# Altium project EBPM-RFFE-Ver1.PrjPCB (part 1 of 3)
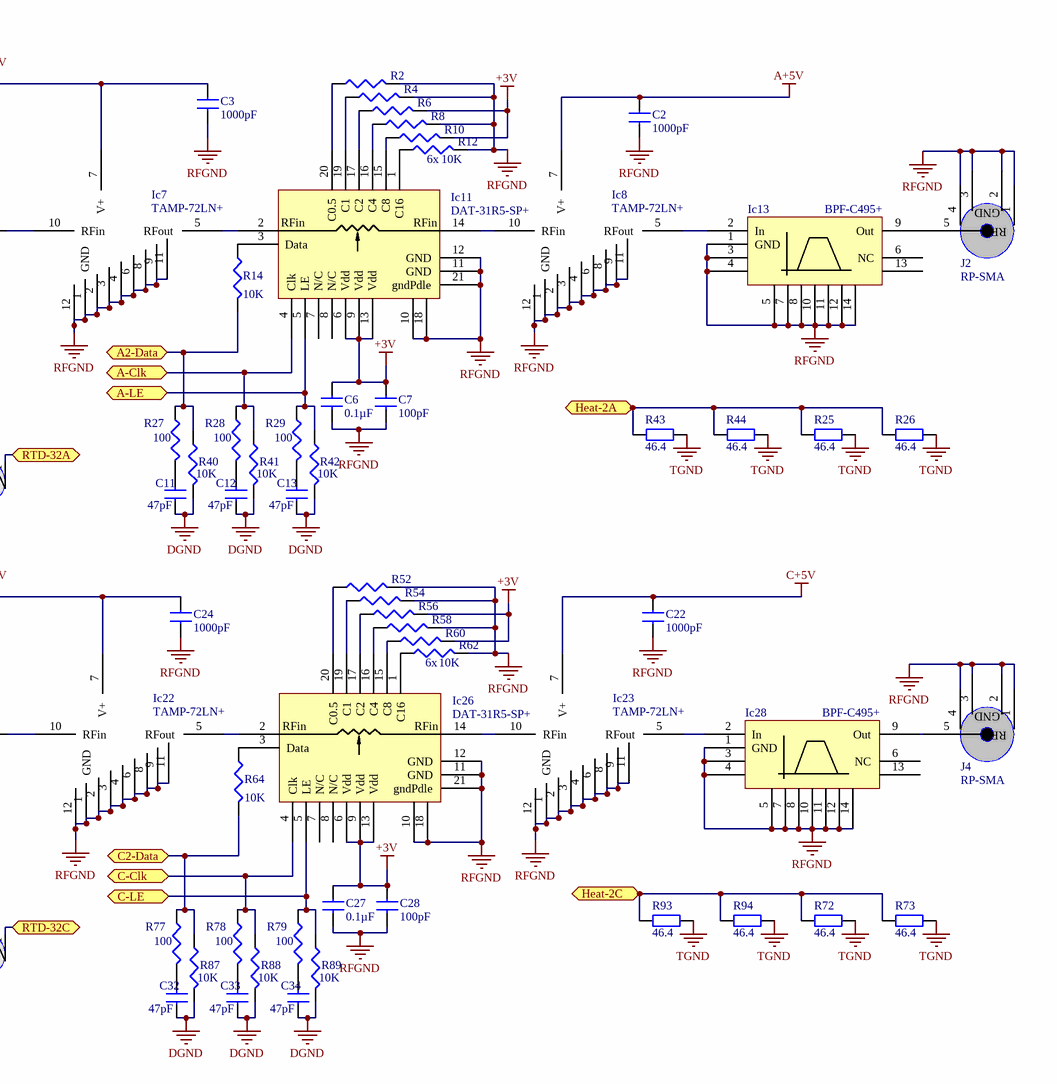
[diagram p0: RFFE-Ver1.SchDoc, top right]
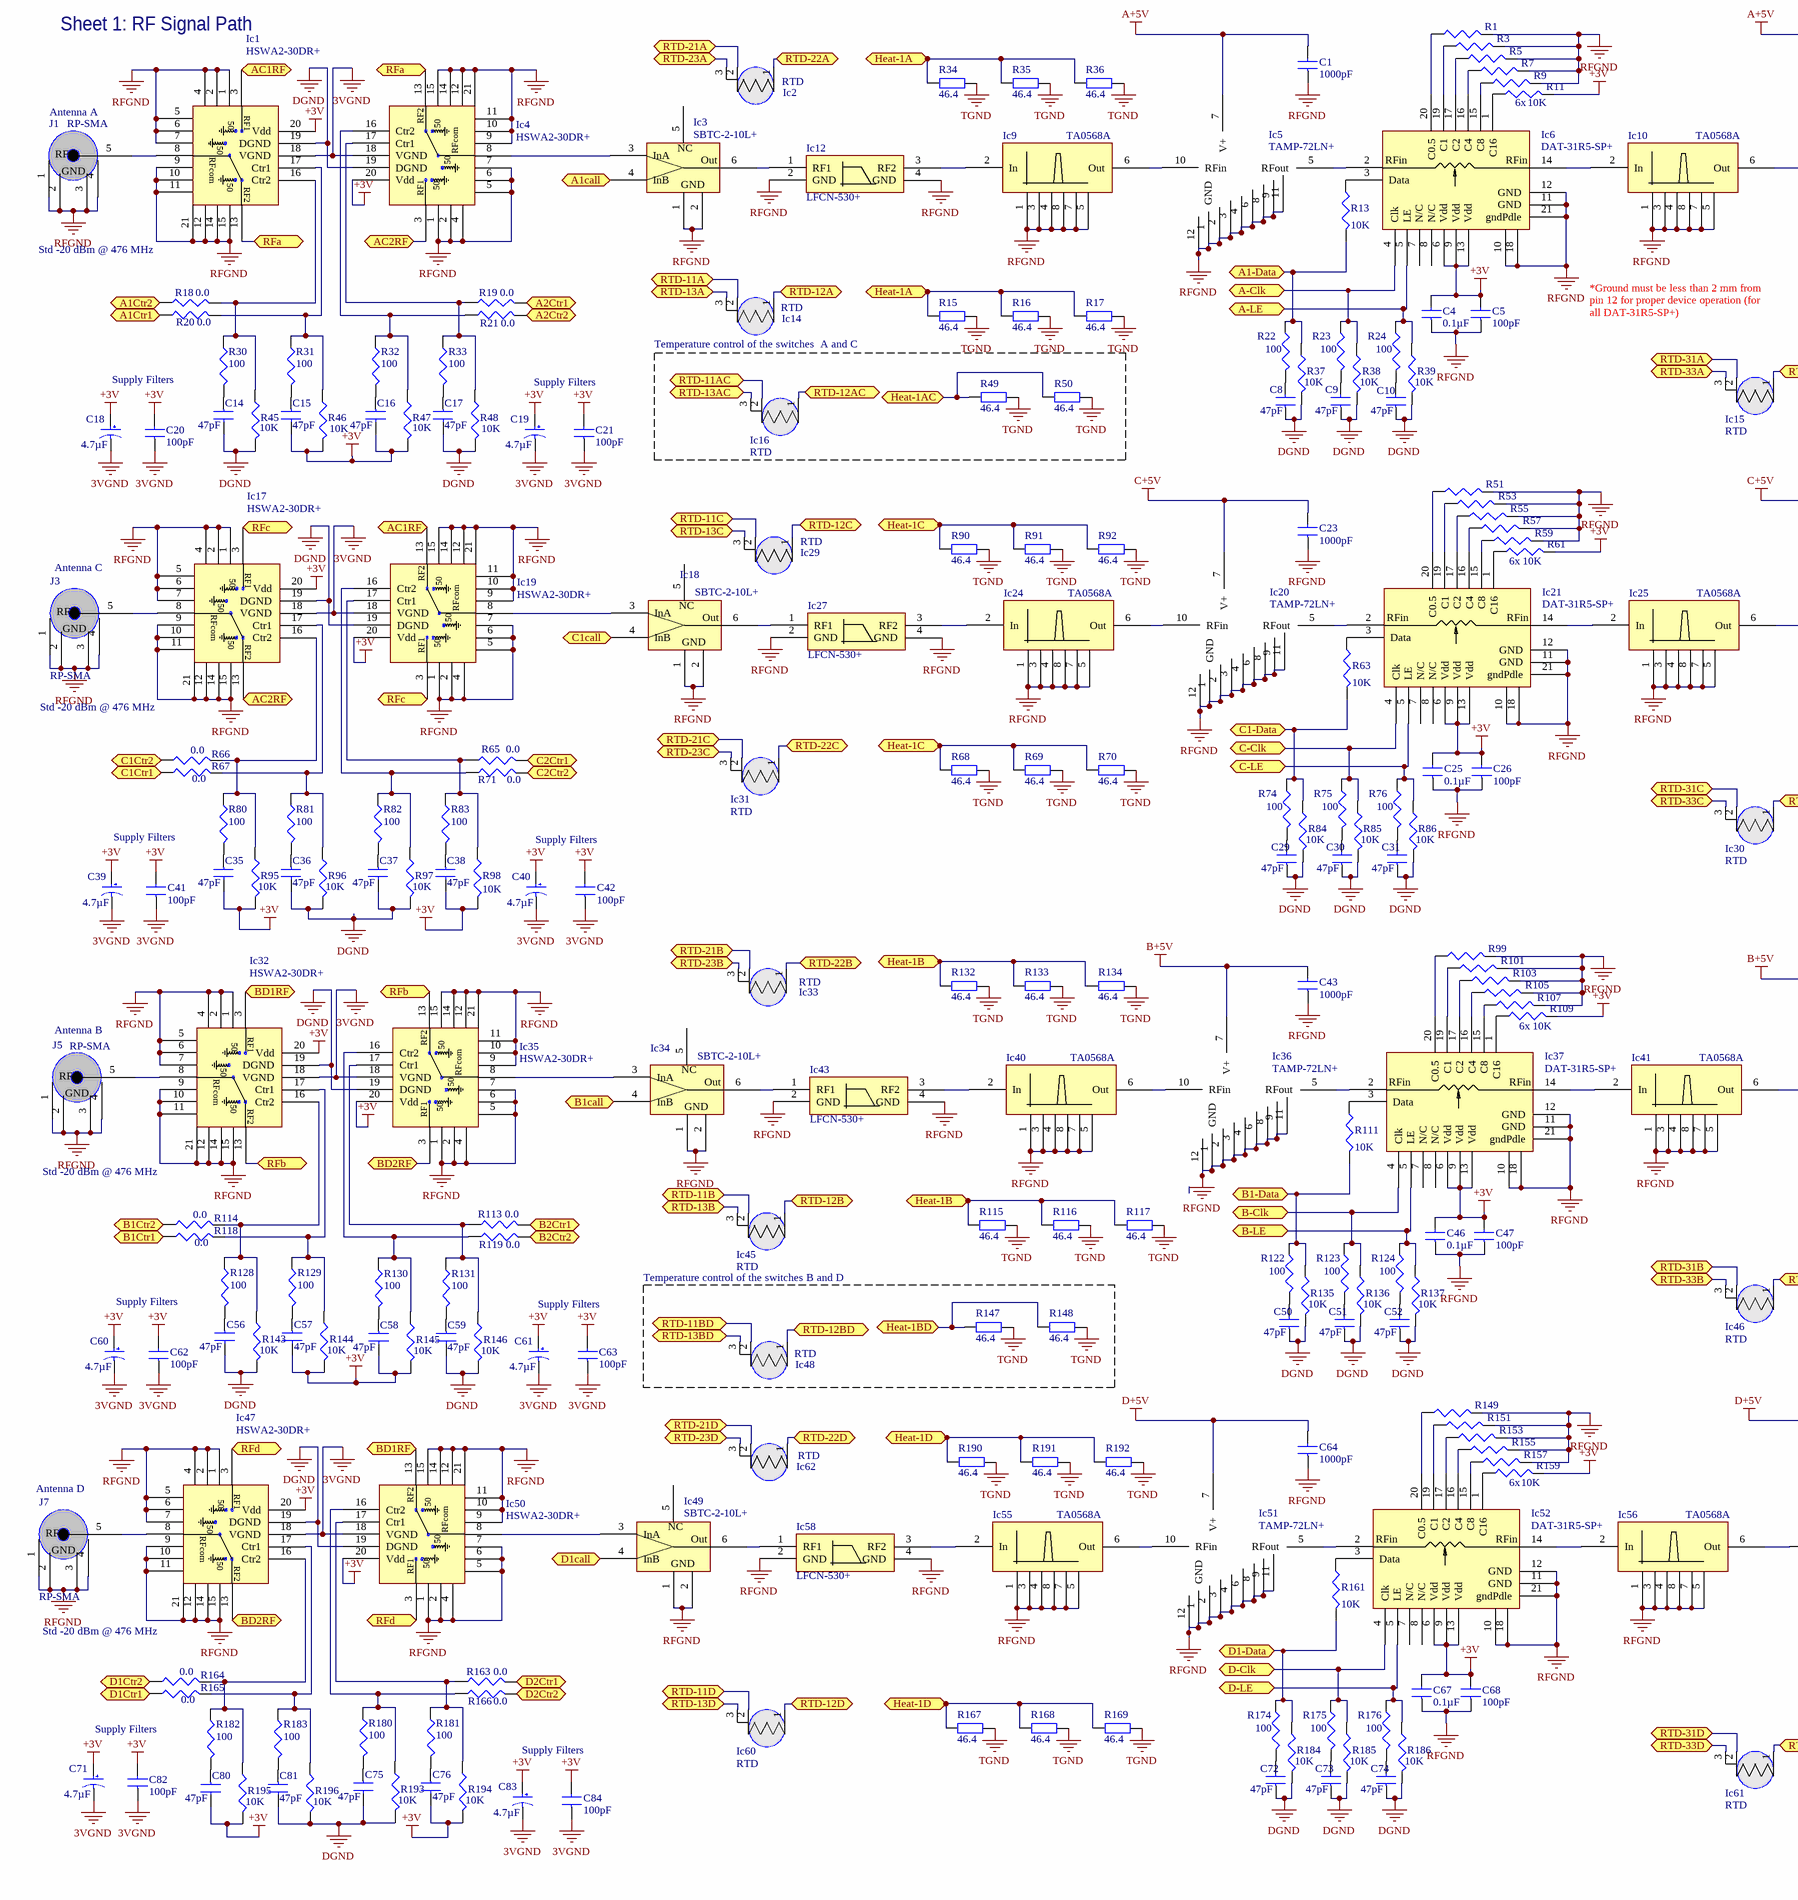
[diagram p1: RFFE-Ver1.SchDoc, bottom left]
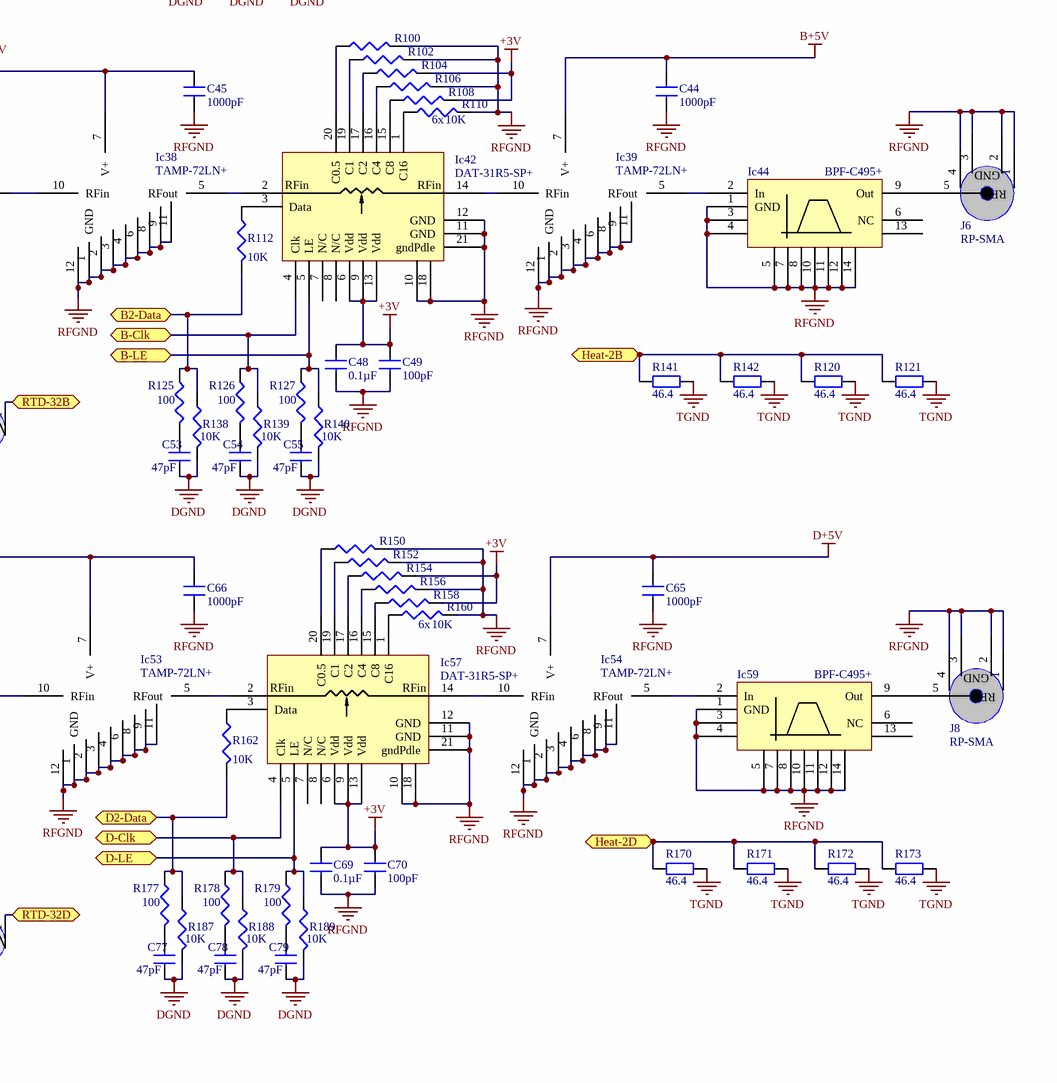
[diagram p2: RFFE-Ver1.SchDoc, bottom right]
3 sheets, 522 parts. Net scope: global (net labels, ports and power ports of the same name join across sheets).
Board file: RFFE-Ver1A.PcbDoc
Sheets:
  RFFE-Ver1.SchDoc
  RFFE-Pilot-Ver1.SchDoc
  RFFE-Supply-Ver1.SchDoc

## Sheet RFFE-Ver1.SchDoc: EBPM-RFFE - Versão 1
size A2; DrawnBy: *Rafael Baron; SheetNumber: 1; SheetTotal: 3; PageSetup: Record=PageOptions|CenterHorizontal=True|CenterVertical=True|PrintScale=0.50|XCorrection=1.00|YCorrection=1.00|PrintKind=1|BorderSize=5000000|LeftOffset=0|BottomOffset=0|Orientation=2|PaperLength=1000|PaperWidth=1000|Scale=100|PaperSource=15|PrintQuality=600|MediaType=1|DitherType=10|PaperKind=A4|PrintScaleMode=1; EBPM-RFFE - Versão 1: EBPM-RFFE - Versão 1

### Parts
C1  Capacitance: 1000pF  [CAPC1608M]  (hidden comment: C1608C0G1H102J)
C2  Capacitance: 1000pF  [CAPC1608M]  (hidden comment: C1608C0G1H102J)
C3  Capacitance: 1000pF  [CAPC1608M]  (hidden comment: C1608C0G1H102J)
C4  Capacitance: 0.1µF  [CAPC3216M]  (hidden comment: CAP CER 0.1UF)
C5  Capacitance: 100pF  [CAPC1608N]  (hidden comment: C1608C0G1H101J)
C6  Capacitance: 0.1µF  [CAPC3216M]  (hidden comment: CAP CER 0.1UF)
C7  Capacitance: 100pF  [CAPC1608N]  (hidden comment: C1608C0G1H101J)
C8  Capacitance: 47pF  [CAPC1608N]  (hidden comment: C1608C0G1H470J)
C9  Capacitance: 47pF  [CAPC1608N]  (hidden comment: C1608C0G1H470J)
C10  Capacitance: 47pF  [CAPC1608N]  (hidden comment: C1608C0G1H470J)
C11  Capacitance: 47pF  [CAPC1608N]  (hidden comment: C1608C0G1H470J)
C12  Capacitance: 47pF  [CAPC1608N]  (hidden comment: C1608C0G1H470J)
C13  Capacitance: 47pF  [CAPC1608N]  (hidden comment: C1608C0G1H470J)
C14  Capacitance: 47pF  [CAPC1608N]  (hidden comment: C1608C0G1H470J)
C15  Capacitance: 47pF  [CAPC1608N]  (hidden comment: C1608C0G1H470J)
C16  Capacitance: 47pF  [CAPC1608N]  (hidden comment: C1608C0G1H470J)
C17  Capacitance: 47pF  [CAPC1608N]  (hidden comment: C1608C0G1H470J)
C18  Capacitance: 4.7µF  [TC3528-1411]  (hidden comment: CAP TANT 4.7UF)
C19  Capacitance: 4.7µF  [TC3528-1411]  (hidden comment: CAP TANT 4.7UF)
C20  Capacitance: 100pF  [CAPC1608N]  (hidden comment: C1608C0G1H101J)
C21  Capacitance: 100pF  [CAPC1608N]  (hidden comment: C1608C0G1H101J)
C22  Capacitance: 1000pF  [CAPC1608M]  (hidden comment: C1608C0G1H102J)
C23  Capacitance: 1000pF  [CAPC1608M]  (hidden comment: C1608C0G1H102J)
C24  Capacitance: 1000pF  [CAPC1608M]  (hidden comment: C1608C0G1H102J)
C25  Capacitance: 0.1µF  [CAPC3216M]  (hidden comment: CAP CER 0.1UF)
C26  Capacitance: 100pF  [CAPC1608N]  (hidden comment: C1608C0G1H101J)
C27  Capacitance: 0.1µF  [CAPC3216M]  (hidden comment: CAP CER 0.1UF)
C28  Capacitance: 100pF  [CAPC1608N]  (hidden comment: C1608C0G1H101J)
C29  Capacitance: 47pF  [CAPC1608N]  (hidden comment: C1608C0G1H470J)
C30  Capacitance: 47pF  [CAPC1608N]  (hidden comment: C1608C0G1H470J)
C31  Capacitance: 47pF  [CAPC1608N]  (hidden comment: C1608C0G1H470J)
C32  Capacitance: 47pF  [CAPC1608N]  (hidden comment: C1608C0G1H470J)
C33  Capacitance: 47pF  [CAPC1608N]  (hidden comment: C1608C0G1H470J)
C34  Capacitance: 47pF  [CAPC1608N]  (hidden comment: C1608C0G1H470J)
C35  Capacitance: 47pF  [CAPC1608N]  (hidden comment: C1608C0G1H470J)
C36  Capacitance: 47pF  [CAPC1608N]  (hidden comment: C1608C0G1H470J)
C37  Capacitance: 47pF  [CAPC1608N]  (hidden comment: C1608C0G1H470J)
C38  Capacitance: 47pF  [CAPC1608N]  (hidden comment: C1608C0G1H470J)
C39  Capacitance: 4.7µF  [TC3528-1411]  (hidden comment: CAP TANT 4.7UF)
C40  Capacitance: 4.7µF  [TC3528-1411]  (hidden comment: CAP TANT 4.7UF)
C41  Capacitance: 100pF  [CAPC1608N]  (hidden comment: C1608C0G1H101J)
C42  Capacitance: 100pF  [CAPC1608N]  (hidden comment: C1608C0G1H101J)
C43  Capacitance: 1000pF  [CAPC1608M]  (hidden comment: C1608C0G1H102J)
C44  Capacitance: 1000pF  [CAPC1608M]  (hidden comment: C1608C0G1H102J)
C45  Capacitance: 1000pF  [CAPC1608M]  (hidden comment: C1608C0G1H102J)
C46  Capacitance: 0.1µF  [CAPC3216M]  (hidden comment: CAP CER 0.1UF)
C47  Capacitance: 100pF  [CAPC1608N]  (hidden comment: C1608C0G1H101J)
C48  Capacitance: 0.1µF  [CAPC3216M]  (hidden comment: CAP CER 0.1UF)
C49  Capacitance: 100pF  [CAPC1608N]  (hidden comment: C1608C0G1H101J)
C50  Capacitance: 47pF  [CAPC1608N]  (hidden comment: C1608C0G1H470J)
C51  Capacitance: 47pF  [CAPC1608N]  (hidden comment: C1608C0G1H470J)
C52  Capacitance: 47pF  [CAPC1608N]  (hidden comment: C1608C0G1H470J)
C53  Capacitance: 47pF  [CAPC1608N]  (hidden comment: C1608C0G1H470J)
C54  Capacitance: 47pF  [CAPC1608N]  (hidden comment: C1608C0G1H470J)
C55  Capacitance: 47pF  [CAPC1608N]  (hidden comment: C1608C0G1H470J)
C56  Capacitance: 47pF  [CAPC1608N]  (hidden comment: C1608C0G1H470J)
C57  Capacitance: 47pF  [CAPC1608N]  (hidden comment: C1608C0G1H470J)
C58  Capacitance: 47pF  [CAPC1608N]  (hidden comment: C1608C0G1H470J)
C59  Capacitance: 47pF  [CAPC1608N]  (hidden comment: C1608C0G1H470J)
C60  Capacitance: 4.7µF  [TC3528-1411]  (hidden comment: CAP TANT 4.7UF)
C61  Capacitance: 4.7µF  [TC3528-1411]  (hidden comment: CAP TANT 4.7UF)
C62  Capacitance: 100pF  [CAPC1608N]  (hidden comment: C1608C0G1H101J)
C63  Capacitance: 100pF  [CAPC1608N]  (hidden comment: C1608C0G1H101J)
C64  Capacitance: 1000pF  [CAPC1608M]  (hidden comment: C1608C0G1H102J)
C65  Capacitance: 1000pF  [CAPC1608M]  (hidden comment: C1608C0G1H102J)
C66  Capacitance: 1000pF  [CAPC1608M]  (hidden comment: C1608C0G1H102J)
C67  Capacitance: 0.1µF  [CAPC3216M]  (hidden comment: CAP CER 0.1UF)
C68  Capacitance: 100pF  [CAPC1608N]  (hidden comment: C1608C0G1H101J)
C69  Capacitance: 0.1µF  [CAPC3216M]  (hidden comment: CAP CER 0.1UF)
C70  Capacitance: 100pF  [CAPC1608N]  (hidden comment: C1608C0G1H101J)
C71  Capacitance: 4.7µF  [TC3528-1411]  (hidden comment: CAP TANT 4.7UF)
C72  Capacitance: 47pF  [CAPC1608N]  (hidden comment: C1608C0G1H470J)
C73  Capacitance: 47pF  [CAPC1608N]  (hidden comment: C1608C0G1H470J)
C74  Capacitance: 47pF  [CAPC1608N]  (hidden comment: C1608C0G1H470J)
C75  Capacitance: 47pF  [CAPC1608N]  (hidden comment: C1608C0G1H470J)
C76  Capacitance: 47pF  [CAPC1608N]  (hidden comment: C1608C0G1H470J)
C77  Capacitance: 47pF  [CAPC1608N]  (hidden comment: C1608C0G1H470J)
C78  Capacitance: 47pF  [CAPC1608N]  (hidden comment: C1608C0G1H470J)
C79  Capacitance: 47pF  [CAPC1608N]  (hidden comment: C1608C0G1H470J)
C80  Capacitance: 47pF  [CAPC1608N]  (hidden comment: C1608C0G1H470J)
C81  Capacitance: 47pF  [CAPC1608N]  (hidden comment: C1608C0G1H470J)
C82  Capacitance: 100pF  [CAPC1608N]  (hidden comment: C1608C0G1H101J)
C83  Capacitance: 4.7µF  [TC3528-1411]  (hidden comment: CAP TANT 4.7UF)
C84  Capacitance: 100pF  [CAPC1608N]  (hidden comment: C1608C0G1H101J)
Ic1  HSWA2-30DR+  [DG983-1]
Ic2  Thermistor Type: RTD  [RTDx2]  (hidden comment: DETECTOR RTD TF 100 OHM +/-0.06%)
Ic3  SBTC-2-10L+  [AT1029]
Ic4  HSWA2-30DR+  [DG983-1]
Ic5  TAMP-72LN+  [JQ1382]
Ic6  DAT-31R5-SP+  [DG983-1]
Ic7  TAMP-72LN+  [JQ1382]
Ic8  TAMP-72LN+  [JQ1382]
Ic9  TA0568A  [TST-TA0568A]
Ic10  TA0568A  [TST-TA0568A]
Ic11  DAT-31R5-SP+  [DG983-1]
Ic12  LFCN-530+  [FV1206]
Ic13  BPF-C495+  [HU1186]
Ic14  Thermistor Type: RTD  [RTDx2]  (hidden comment: DETECTOR RTD TF 100 OHM +/-0.06%)
Ic15  Thermistor Type: RTD  [RTDx2]  (hidden comment: DETECTOR RTD TF 100 OHM +/-0.06%)
Ic16  Thermistor Type: RTD  [RTDx2]  (hidden comment: DETECTOR RTD TF 100 OHM +/-0.06%)
Ic17  HSWA2-30DR+  [DG983-1]
Ic18  SBTC-2-10L+  [AT1029]
Ic19  HSWA2-30DR+  [DG983-1]
Ic20  TAMP-72LN+  [JQ1382]
Ic21  DAT-31R5-SP+  [DG983-1]
Ic22  TAMP-72LN+  [JQ1382]
Ic23  TAMP-72LN+  [JQ1382]
Ic24  TA0568A  [TST-TA0568A]
Ic25  TA0568A  [TST-TA0568A]
Ic26  DAT-31R5-SP+  [DG983-1]
Ic27  LFCN-530+  [FV1206]
Ic28  BPF-C495+  [HU1186]
Ic29  Thermistor Type: RTD  [RTDx2]  (hidden comment: DETECTOR RTD TF 100 OHM +/-0.06%)
Ic30  Thermistor Type: RTD  [RTDx2]  (hidden comment: DETECTOR RTD TF 100 OHM +/-0.06%)
Ic31  Thermistor Type: RTD  [RTDx2]  (hidden comment: DETECTOR RTD TF 100 OHM +/-0.06%)
Ic32  HSWA2-30DR+  [DG983-1]
Ic33  Thermistor Type: RTD  [RTDx2]  (hidden comment: DETECTOR RTD TF 100 OHM +/-0.06%)
Ic34  SBTC-2-10L+  [AT1029]
Ic35  HSWA2-30DR+  [DG983-1]
Ic36  TAMP-72LN+  [JQ1382]
Ic37  DAT-31R5-SP+  [DG983-1]
Ic38  TAMP-72LN+  [JQ1382]
Ic39  TAMP-72LN+  [JQ1382]
Ic40  TA0568A  [TST-TA0568A]
Ic41  TA0568A  [TST-TA0568A]
Ic42  DAT-31R5-SP+  [DG983-1]
Ic43  LFCN-530+  [FV1206]
Ic44  BPF-C495+  [HU1186]
Ic45  Thermistor Type: RTD  [RTDx2]  (hidden comment: DETECTOR RTD TF 100 OHM +/-0.06%)
Ic46  Thermistor Type: RTD  [RTDx2]  (hidden comment: DETECTOR RTD TF 100 OHM +/-0.06%)
Ic47  HSWA2-30DR+  [DG983-1]
Ic48  Thermistor Type: RTD  [RTDx2]  (hidden comment: DETECTOR RTD TF 100 OHM +/-0.06%)
Ic49  SBTC-2-10L+  [AT1029]
Ic50  HSWA2-30DR+  [DG983-1]
Ic51  TAMP-72LN+  [JQ1382]
Ic52  DAT-31R5-SP+  [DG983-1]
Ic53  TAMP-72LN+  [JQ1382]
Ic54  TAMP-72LN+  [JQ1382]
Ic55  TA0568A  [TST-TA0568A]
Ic56  TA0568A  [TST-TA0568A]
Ic57  DAT-31R5-SP+  [DG983-1]
Ic58  LFCN-530+  [FV1206]
Ic59  BPF-C495+  [HU1186]
Ic60  Thermistor Type: RTD  [RTDx2]  (hidden comment: DETECTOR RTD TF 100 OHM +/-0.06%)
Ic61  Thermistor Type: RTD  [RTDx2]  (hidden comment: DETECTOR RTD TF 100 OHM +/-0.06%)
Ic62  Thermistor Type: RTD  [RTDx2]  (hidden comment: DETECTOR RTD TF 100 OHM +/-0.06%)
J1  Connector Style: RP-SMA  [SMAedge50R]  (hidden comment: CONN SMA)
J2  Connector Style: RP-SMA  [SMAedge50R]  (hidden comment: CONN SMA)
J3  Connector Style: RP-SMA  [SMAedge50R]  (hidden comment: CONN SMA)
J4  Connector Style: RP-SMA  [SMAedge50R]  (hidden comment: CONN SMA)
J5  Connector Style: RP-SMA  [SMAedge50R]  (hidden comment: CONN SMA)
J6  Connector Style: RP-SMA  [SMAedge50R]  (hidden comment: CONN SMA)
J7  Connector Style: RP-SMA  [SMAedge50R]  (hidden comment: CONN SMA)
J8  Connector Style: RP-SMA  [SMAedge50R]  (hidden comment: CONN SMA)
R1  PNM0603E1002BST5  [RESC1608N]  (value not drawn)
R2  PNM0603E1002BST5  [RESC1608N]  (value not drawn)
R3  PNM0603E1002BST5  [RESC1608N]  (value not drawn)
R4  PNM0603E1002BST5  [RESC1608N]  (value not drawn)
R5  PNM0603E1002BST5  [RESC1608N]  (value not drawn)
R6  PNM0603E1002BST5  [RESC1608N]  (value not drawn)
R7  PNM0603E1002BST5  [RESC1608N]  (value not drawn)
R8  PNM0603E1002BST5  [RESC1608N]  (value not drawn)
R9  PNM0603E1002BST5  [RESC1608N]  (value not drawn)
R10  PNM0603E1002BST5  [RESC1608N]  (value not drawn)
R11  Resistance (Ohms): 10K  [RESC1608N]  (hidden comment: PNM0603E1002BST5)
R12  Resistance (Ohms): 10K  [RESC1608N]  (hidden comment: PNM0603E1002BST5)
R13  Resistance (Ohms): 10K  [RESC1608N]  (hidden comment: PNM0603E1002BST5)
R14  Resistance (Ohms): 10K  [RESC1608N]  (hidden comment: PNM0603E1002BST5)
R15  Resistance (Ohms): 46.4  [AXIAL9.0]  (hidden comment: CMF5546R400FHEB)
R16  Resistance (Ohms): 46.4  [AXIAL9.0]  (hidden comment: CMF5546R400FHEB)
R17  Resistance (Ohms): 46.4  [AXIAL9.0]  (hidden comment: CMF5546R400FHEB)
R18  Resistance (Ohms): 0.0  [RESC1608M]  (hidden comment: RES 0.0 OHM)
R19  Resistance (Ohms): 0.0  [RESC1608M]  (hidden comment: RES 0.0 OHM)
R20  Resistance (Ohms): 0.0  [RESC1608M]  (hidden comment: RES 0.0 OHM)
R21  Resistance (Ohms): 0.0  [RESC1608M]  (hidden comment: RES 0.0 OHM)
R22  Resistance (Ohms): 100  [RESC1608N]  (hidden comment: FC0603E1000BST1)
R23  Resistance (Ohms): 100  [RESC1608N]  (hidden comment: FC0603E1000BST1)
R24  Resistance (Ohms): 100  [RESC1608N]  (hidden comment: FC0603E1000BST1)
R25  Resistance (Ohms): 46.4  [AXIAL9.0]  (hidden comment: CMF5546R400FHEB)
R26  Resistance (Ohms): 46.4  [AXIAL9.0]  (hidden comment: CMF5546R400FHEB)
R27  Resistance (Ohms): 100  [RESC1608N]  (hidden comment: FC0603E1000BST1)
R28  Resistance (Ohms): 100  [RESC1608N]  (hidden comment: FC0603E1000BST1)
R29  Resistance (Ohms): 100  [RESC1608N]  (hidden comment: FC0603E1000BST1)
R30  Resistance (Ohms): 100  [RESC1608N]  (hidden comment: FC0603E1000BST1)
R31  Resistance (Ohms): 100  [RESC1608N]  (hidden comment: FC0603E1000BST1)
R32  Resistance (Ohms): 100  [RESC1608N]  (hidden comment: FC0603E1000BST1)
R33  Resistance (Ohms): 100  [RESC1608N]  (hidden comment: FC0603E1000BST1)
R34  Resistance (Ohms): 46.4  [AXIAL9.0]  (hidden comment: CMF5546R400FHEB)
R35  Resistance (Ohms): 46.4  [AXIAL9.0]  (hidden comment: CMF5546R400FHEB)
R36  Resistance (Ohms): 46.4  [AXIAL9.0]  (hidden comment: CMF5546R400FHEB)
R37  Resistance (Ohms): 10K  [RESC1608N]  (hidden comment: PNM0603E1002BST5)
R38  Resistance (Ohms): 10K  [RESC1608N]  (hidden comment: PNM0603E1002BST5)
R39  Resistance (Ohms): 10K  [RESC1608N]  (hidden comment: PNM0603E1002BST5)
R40  Resistance (Ohms): 10K  [RESC1608N]  (hidden comment: PNM0603E1002BST5)
R41  Resistance (Ohms): 10K  [RESC1608N]  (hidden comment: PNM0603E1002BST5)
R42  Resistance (Ohms): 10K  [RESC1608N]  (hidden comment: PNM0603E1002BST5)
R43  Resistance (Ohms): 46.4  [AXIAL9.0]  (hidden comment: CMF5546R400FHEB)
R44  Resistance (Ohms): 46.4  [AXIAL9.0]  (hidden comment: CMF5546R400FHEB)
R45  Resistance (Ohms): 10K  [RESC1608N]  (hidden comment: PNM0603E1002BST5)
R46  Resistance (Ohms): 10K  [RESC1608N]  (hidden comment: PNM0603E1002BST5)
R47  Resistance (Ohms): 10K  [RESC1608N]  (hidden comment: PNM0603E1002BST5)
R48  Resistance (Ohms): 10K  [RESC1608N]  (hidden comment: PNM0603E1002BST5)
R49  Resistance (Ohms): 46.4  [AXIAL9.0]  (hidden comment: CMF5546R400FHEB)
R50  Resistance (Ohms): 46.4  [AXIAL9.0]  (hidden comment: CMF5546R400FHEB)
R51  PNM0603E1002BST5  [RESC1608N]  (value not drawn)
R52  PNM0603E1002BST5  [RESC1608N]  (value not drawn)
R53  PNM0603E1002BST5  [RESC1608N]  (value not drawn)
R54  PNM0603E1002BST5  [RESC1608N]  (value not drawn)
R55  PNM0603E1002BST5  [RESC1608N]  (value not drawn)
R56  PNM0603E1002BST5  [RESC1608N]  (value not drawn)
R57  PNM0603E1002BST5  [RESC1608N]  (value not drawn)
R58  PNM0603E1002BST5  [RESC1608N]  (value not drawn)
R59  Resistance (Ohms): 10K  [RESC1608N]  (hidden comment: PNM0603E1002BST5)
R60  PNM0603E1002BST5  [RESC1608N]  (value not drawn)
R61  PNM0603E1002BST5  [RESC1608N]  (value not drawn)
R62  Resistance (Ohms): 10K  [RESC1608N]  (hidden comment: PNM0603E1002BST5)
R63  Resistance (Ohms): 10K  [RESC1608N]  (hidden comment: PNM0603E1002BST5)
R64  Resistance (Ohms): 10K  [RESC1608N]  (hidden comment: PNM0603E1002BST5)
R65  Resistance (Ohms): 0.0  [RESC1608M]  (hidden comment: RES 0.0 OHM)
R66  Resistance (Ohms): 0.0  [RESC1608M]  (hidden comment: RES 0.0 OHM)
R67  Resistance (Ohms): 0.0  [RESC1608M]  (hidden comment: RES 0.0 OHM)
R68  Resistance (Ohms): 46.4  [AXIAL9.0]  (hidden comment: CMF5546R400FHEB)
R69  Resistance (Ohms): 46.4  [AXIAL9.0]  (hidden comment: CMF5546R400FHEB)
R70  Resistance (Ohms): 46.4  [AXIAL9.0]  (hidden comment: CMF5546R400FHEB)
R71  Resistance (Ohms): 0.0  [CAPC1608N]  (hidden comment: ERJ-3GEY0R00V)
R72  Resistance (Ohms): 46.4  [AXIAL9.0]  (hidden comment: CMF5546R400FHEB)
R73  Resistance (Ohms): 46.4  [AXIAL9.0]  (hidden comment: CMF5546R400FHEB)
R74  Resistance (Ohms): 100  [RESC1608N]  (hidden comment: FC0603E1000BST1)
R75  Resistance (Ohms): 100  [RESC1608N]  (hidden comment: FC0603E1000BST1)
R76  Resistance (Ohms): 100  [RESC1608N]  (hidden comment: FC0603E1000BST1)
R77  Resistance (Ohms): 100  [RESC1608N]  (hidden comment: FC0603E1000BST1)
R78  Resistance (Ohms): 100  [RESC1608N]  (hidden comment: FC0603E1000BST1)
R79  Resistance (Ohms): 100  [RESC1608N]  (hidden comment: FC0603E1000BST1)
R80  Resistance (Ohms): 100  [RESC1608N]  (hidden comment: FC0603E1000BST1)
R81  Resistance (Ohms): 100  [RESC1608N]  (hidden comment: FC0603E1000BST1)
R82  Resistance (Ohms): 100  [RESC1608N]  (hidden comment: FC0603E1000BST1)
R83  Resistance (Ohms): 100  [RESC1608N]  (hidden comment: FC0603E1000BST1)
R84  Resistance (Ohms): 10K  [RESC1608N]  (hidden comment: PNM0603E1002BST5)
R85  Resistance (Ohms): 10K  [RESC1608N]  (hidden comment: PNM0603E1002BST5)
R86  Resistance (Ohms): 10K  [RESC1608N]  (hidden comment: PNM0603E1002BST5)
R87  Resistance (Ohms): 10K  [RESC1608N]  (hidden comment: PNM0603E1002BST5)
R88  Resistance (Ohms): 10K  [RESC1608N]  (hidden comment: PNM0603E1002BST5)
R89  Resistance (Ohms): 10K  [RESC1608N]  (hidden comment: PNM0603E1002BST5)
R90  Resistance (Ohms): 46.4  [AXIAL9.0]  (hidden comment: CMF5546R400FHEB)
R91  Resistance (Ohms): 46.4  [AXIAL9.0]  (hidden comment: CMF5546R400FHEB)
R92  Resistance (Ohms): 46.4  [AXIAL9.0]  (hidden comment: CMF5546R400FHEB)
R93  Resistance (Ohms): 46.4  [AXIAL9.0]  (hidden comment: CMF5546R400FHEB)
R94  Resistance (Ohms): 46.4  [AXIAL9.0]  (hidden comment: CMF5546R400FHEB)
R95  Resistance (Ohms): 10K  [RESC1608N]  (hidden comment: PNM0603E1002BST5)
R96  Resistance (Ohms): 10K  [RESC1608N]  (hidden comment: PNM0603E1002BST5)
R97  Resistance (Ohms): 10K  [RESC1608N]  (hidden comment: PNM0603E1002BST5)
R98  Resistance (Ohms): 10K  [RESC1608N]  (hidden comment: PNM0603E1002BST5)
R99  PNM0603E1002BST5  [RESC1608N]  (value not drawn)
R100  PNM0603E1002BST5  [RESC1608N]  (value not drawn)
R101  PNM0603E1002BST5  [RESC1608N]  (value not drawn)
R102  PNM0603E1002BST5  [RESC1608N]  (value not drawn)
R103  PNM0603E1002BST5  [RESC1608N]  (value not drawn)
R104  PNM0603E1002BST5  [RESC1608N]  (value not drawn)
R105  PNM0603E1002BST5  [RESC1608N]  (value not drawn)
R106  PNM0603E1002BST5  [RESC1608N]  (value not drawn)
R107  PNM0603E1002BST5  [RESC1608N]  (value not drawn)
R108  PNM0603E1002BST5  [RESC1608N]  (value not drawn)
R109  Resistance (Ohms): 10K  [RESC1608N]  (hidden comment: PNM0603E1002BST5)
R110  Resistance (Ohms): 10K  [RESC1608N]  (hidden comment: PNM0603E1002BST5)
R111  Resistance (Ohms): 10K  [RESC1608N]  (hidden comment: PNM0603E1002BST5)
R112  Resistance (Ohms): 10K  [RESC1608N]  (hidden comment: PNM0603E1002BST5)
R113  Resistance (Ohms): 0.0  [RESC1608M]  (hidden comment: RES 0.0 OHM)
R114  Resistance (Ohms): 0.0  [RESC1608M]  (hidden comment: RES 0.0 OHM)
R115  Resistance (Ohms): 46.4  [AXIAL9.0]  (hidden comment: CMF5546R400FHEB)
R116  Resistance (Ohms): 46.4  [AXIAL9.0]  (hidden comment: CMF5546R400FHEB)
R117  Resistance (Ohms): 46.4  [AXIAL9.0]  (hidden comment: CMF5546R400FHEB)
R118  Resistance (Ohms): 0.0  [RESC1608M]  (hidden comment: RES 0.0 OHM)
R119  Resistance (Ohms): 0.0  [RESC1608M]  (hidden comment: RES 0.0 OHM)
R120  Resistance (Ohms): 46.4  [AXIAL9.0]  (hidden comment: CMF5546R400FHEB)
R121  Resistance (Ohms): 46.4  [AXIAL9.0]  (hidden comment: CMF5546R400FHEB)
R122  Resistance (Ohms): 100  [RESC1608N]  (hidden comment: FC0603E1000BST1)
R123  Resistance (Ohms): 100  [RESC1608N]  (hidden comment: FC0603E1000BST1)
R124  Resistance (Ohms): 100  [RESC1608N]  (hidden comment: FC0603E1000BST1)
R125  Resistance (Ohms): 100  [RESC1608N]  (hidden comment: FC0603E1000BST1)
R126  Resistance (Ohms): 100  [RESC1608N]  (hidden comment: FC0603E1000BST1)
R127  Resistance (Ohms): 100  [RESC1608N]  (hidden comment: FC0603E1000BST1)
R128  Resistance (Ohms): 100  [RESC1608N]  (hidden comment: FC0603E1000BST1)
R129  Resistance (Ohms): 100  [RESC1608N]  (hidden comment: FC0603E1000BST1)
R130  Resistance (Ohms): 100  [RESC1608N]  (hidden comment: FC0603E1000BST1)
R131  Resistance (Ohms): 100  [RESC1608N]  (hidden comment: FC0603E1000BST1)
R132  Resistance (Ohms): 46.4  [AXIAL9.0]  (hidden comment: CMF5546R400FHEB)
R133  Resistance (Ohms): 46.4  [AXIAL9.0]  (hidden comment: CMF5546R400FHEB)
R134  Resistance (Ohms): 46.4  [AXIAL9.0]  (hidden comment: CMF5546R400FHEB)
R135  Resistance (Ohms): 10K  [RESC1608N]  (hidden comment: PNM0603E1002BST5)
R136  Resistance (Ohms): 10K  [RESC1608N]  (hidden comment: PNM0603E1002BST5)
R137  Resistance (Ohms): 10K  [RESC1608N]  (hidden comment: PNM0603E1002BST5)
R138  Resistance (Ohms): 10K  [RESC1608N]  (hidden comment: PNM0603E1002BST5)
R139  Resistance (Ohms): 10K  [RESC1608N]  (hidden comment: PNM0603E1002BST5)
R140  Resistance (Ohms): 10K  [RESC1608N]  (hidden comment: PNM0603E1002BST5)
R141  Resistance (Ohms): 46.4  [AXIAL9.0]  (hidden comment: CMF5546R400FHEB)
R142  Resistance (Ohms): 46.4  [AXIAL9.0]  (hidden comment: CMF5546R400FHEB)
R143  Resistance (Ohms): 10K  [RESC1608N]  (hidden comment: PNM0603E1002BST5)
R144  Resistance (Ohms): 10K  [RESC1608N]  (hidden comment: PNM0603E1002BST5)
R145  Resistance (Ohms): 10K  [RESC1608N]  (hidden comment: PNM0603E1002BST5)
R146  Resistance (Ohms): 10K  [RESC1608N]  (hidden comment: PNM0603E1002BST5)
R147  Resistance (Ohms): 46.4  [AXIAL9.0]  (hidden comment: CMF5546R400FHEB)
R148  Resistance (Ohms): 46.4  [AXIAL9.0]  (hidden comment: CMF5546R400FHEB)
R149  PNM0603E1002BST5  [RESC1608N]  (value not drawn)
R150  PNM0603E1002BST5  [RESC1608N]  (value not drawn)
R151  PNM0603E1002BST5  [RESC1608N]  (value not drawn)
R152  PNM0603E1002BST5  [RESC1608N]  (value not drawn)
R153  PNM0603E1002BST5  [RESC1608N]  (value not drawn)
R154  PNM0603E1002BST5  [RESC1608N]  (value not drawn)
R155  PNM0603E1002BST5  [RESC1608N]  (value not drawn)
R156  PNM0603E1002BST5  [RESC1608N]  (value not drawn)
R157  PNM0603E1002BST5  [RESC1608N]  (value not drawn)
R158  PNM0603E1002BST5  [RESC1608N]  (value not drawn)
R159  Resistance (Ohms): 10K  [RESC1608N]  (hidden comment: PNM0603E1002BST5)
R160  Resistance (Ohms): 10K  [RESC1608N]  (hidden comment: PNM0603E1002BST5)
R161  Resistance (Ohms): 10K  [RESC1608N]  (hidden comment: PNM0603E1002BST5)
R162  Resistance (Ohms): 10K  [RESC1608N]  (hidden comment: PNM0603E1002BST5)
R163  Resistance (Ohms): 0.0  [RESC1608M]  (hidden comment: RES 0.0 OHM)
R164  Resistance (Ohms): 0.0  [RESC1608M]  (hidden comment: RES 0.0 OHM)
R165  Resistance (Ohms): 0.0  [RESC1608M]  (hidden comment: RES 0.0 OHM)
R166  Resistance (Ohms): 0.0  [RESC1608M]  (hidden comment: RES 0.0 OHM)
R167  Resistance (Ohms): 46.4  [AXIAL9.0]  (hidden comment: CMF5546R400FHEB)
R168  Resistance (Ohms): 46.4  [AXIAL9.0]  (hidden comment: CMF5546R400FHEB)
R169  Resistance (Ohms): 46.4  [AXIAL9.0]  (hidden comment: CMF5546R400FHEB)
R170  Resistance (Ohms): 46.4  [AXIAL9.0]  (hidden comment: CMF5546R400FHEB)
R171  Resistance (Ohms): 46.4  [AXIAL9.0]  (hidden comment: CMF5546R400FHEB)
R172  Resistance (Ohms): 46.4  [AXIAL9.0]  (hidden comment: CMF5546R400FHEB)
R173  Resistance (Ohms): 46.4  [AXIAL9.0]  (hidden comment: CMF5546R400FHEB)
R174  Resistance (Ohms): 100  [RESC1608N]  (hidden comment: FC0603E1000BST1)
R175  Resistance (Ohms): 100  [RESC1608N]  (hidden comment: FC0603E1000BST1)
R176  Resistance (Ohms): 100  [RESC1608N]  (hidden comment: FC0603E1000BST1)
R177  Resistance (Ohms): 100  [RESC1608N]  (hidden comment: FC0603E1000BST1)
R178  Resistance (Ohms): 100  [RESC1608N]  (hidden comment: FC0603E1000BST1)
R179  Resistance (Ohms): 100  [RESC1608N]  (hidden comment: FC0603E1000BST1)
R180  Resistance (Ohms): 100  [RESC1608N]  (hidden comment: FC0603E1000BST1)
R181  Resistance (Ohms): 100  [RESC1608N]  (hidden comment: FC0603E1000BST1)
R182  Resistance (Ohms): 100  [RESC1608N]  (hidden comment: FC0603E1000BST1)
R183  Resistance (Ohms): 100  [RESC1608N]  (hidden comment: FC0603E1000BST1)
R184  Resistance (Ohms): 10K  [RESC1608N]  (hidden comment: PNM0603E1002BST5)
R185  Resistance (Ohms): 10K  [RESC1608N]  (hidden comment: PNM0603E1002BST5)
R186  Resistance (Ohms): 10K  [RESC1608N]  (hidden comment: PNM0603E1002BST5)
R187  Resistance (Ohms): 10K  [RESC1608N]  (hidden comment: PNM0603E1002BST5)
R188  Resistance (Ohms): 10K  [RESC1608N]  (hidden comment: PNM0603E1002BST5)
R189  Resistance (Ohms): 10K  [RESC1608N]  (hidden comment: PNM0603E1002BST5)
R190  Resistance (Ohms): 46.4  [AXIAL9.0]  (hidden comment: CMF5546R400FHEB)
R191  Resistance (Ohms): 46.4  [AXIAL9.0]  (hidden comment: CMF5546R400FHEB)
R192  Resistance (Ohms): 46.4  [AXIAL9.0]  (hidden comment: CMF5546R400FHEB)
R193  Resistance (Ohms): 10K  [RESC1608N]  (hidden comment: PNM0603E1002BST5)
R194  Resistance (Ohms): 10K  [RESC1608N]  (hidden comment: PNM0603E1002BST5)
R195  Resistance (Ohms): 10K  [RESC1608N]  (hidden comment: PNM0603E1002BST5)
R196  Resistance (Ohms): 10K  [RESC1608N]  (hidden comment: PNM0603E1002BST5)

### Blocks framed on the sheet
Temperature control of the switches  A and C: Ic16 R49 R50
Temperature control of the switches B and D: Ic48 R147 R148

### Ports
A1-Data, A1call, A1Ctr1, A1Ctr2, A2-Data, A2Ctr1, A2Ctr2, A-Clk, A-LE, AC1RF, AC2RF, B1-Data, B1call, B1Ctr1, B1Ctr2, B2-Data, B2Ctr1, B2Ctr2, B-Clk, B-LE, BD1RF, BD2RF, C1-Data, C1call, C1Ctr1, C1Ctr2, C2-Data, C2Ctr1, C2Ctr2, C-Clk, C-LE, D1-Data, D1call, D1Ctr1, D1Ctr2, D2-Data, D2Ctr1, D2Ctr2, D-Clk, D-LE, Heat-1A, Heat-1AC, Heat-1B, Heat-1BD, Heat-1C, Heat-1D, Heat-2A, Heat-2B, Heat-2C, Heat-2D, RFa, RFb, RFc, RFd, RTD-11A, RTD-11AC, RTD-11B, RTD-11BD, RTD-11C, RTD-11D, RTD-12A, RTD-12AC, RTD-12B, RTD-12BD, RTD-12C, RTD-12D, RTD-13A, RTD-13AC, RTD-13B, RTD-13BD, RTD-13C, RTD-13D, RTD-21A, RTD-21B, RTD-21C, RTD-21D, RTD-22A, RTD-22B, RTD-22C, RTD-22D, RTD-23A, RTD-23B, RTD-23C, RTD-23D, RTD-31A, RTD-31B, RTD-31C, RTD-31D, RTD-32A, RTD-32B, RTD-32C, RTD-32D, RTD-33A, RTD-33B, RTD-33C, RTD-33D

### Nets
3VGND: C18.2 C19.2 C20.2 C21.2 C39.2 C40.2 C41.2 C42.2 C60.2 C61.2 C62.2 C63.2 C71.2 C82.2 C83.2 C84.2 Ic1.18(VGND) Ic4.18(VGND) Ic17.18(VGND) Ic19.18(VGND) Ic32.18(VGND) Ic35.18(VGND) Ic47.18(VGND) Ic50.18(VGND)
+3V: C4.1 C5.1 C6.1 C7.1 C15.1 C16.1 C18.1 C19.1 C20.1 C21.1 C25.1 C26.1 C27.1 C28.1 C35.1 C38.1 C39.1 C40.1 C41.1 C42.1 C46.1 C47.1 C48.1 C49.1 C57.1 C58.1 C60.1 C61.1 C62.1 C63.1 C67.1 C68.1 C69.1 C70.1 C71.1 C76.1 C80.1 C82.1 C83.1 C84.1 Ic1.20(Vdd) Ic4.20(Vdd) Ic6.6(Vdd) Ic6.9(Vdd) Ic6.13(Vdd) Ic11.6(Vdd) Ic11.9(Vdd) Ic11.13(Vdd) Ic17.20(Vdd) Ic19.20(Vdd) Ic21.6(Vdd) Ic21.9(Vdd) Ic21.13(Vdd) Ic26.6(Vdd) Ic26.9(Vdd) Ic26.13(Vdd) Ic32.20(Vdd) Ic35.20(Vdd) Ic37.6(Vdd) Ic37.9(Vdd) Ic37.13(Vdd) Ic42.6(Vdd) Ic42.9(Vdd) Ic42.13(Vdd) Ic47.20(Vdd) Ic50.20(Vdd) Ic52.6(Vdd) Ic52.9(Vdd) Ic52.13(Vdd) Ic57.6(Vdd) Ic57.9(Vdd) Ic57.13(Vdd) R6.1 R10.1 R11.1 R46.1 R47.1 R56.1 R60.1 R61.1 R95.1 R98.1 R104.1 R108.1 R109.1 R144.1 R145.1 R154.1 R158.1 R159.1 R194.1 R195.1
A+5V: C1.1 C2.1 C3.1 Ic5.7(V+) Ic7.7(V+) Ic8.7(V+)
B+5V: C43.1 C44.1 C45.1 Ic36.7(V+) Ic38.7(V+) Ic39.7(V+)
C+5V: C22.1 C23.1 C24.1 Ic20.7(V+) Ic22.7(V+) Ic23.7(V+)
D+5V: C64.1 C65.1 C66.1 Ic51.7(V+) Ic53.7(V+) Ic54.7(V+)
DGND: C8.2 C9.2 C10.2 C11.2 C12.2 C13.2 C14.1 C17.1 C29.2 C30.2 C31.2 C32.2 C33.2 C34.2 C36.1 C37.1 C50.2 C51.2 C52.2 C53.2 C54.2 C55.2 C56.1 C59.1 C72.2 C73.2 C74.2 C75.1 C77.2 C78.2 C79.2 C81.1 Ic1.19(DGND) Ic4.19(DGND) Ic17.19(DGND) Ic19.19(DGND) Ic32.19(DGND) Ic35.19(DGND) Ic47.19(DGND) Ic50.19(DGND) R37.1 R38.1 R39.1 R40.1 R41.1 R42.1 R45.1 R48.1 R84.1 R85.1 R86.1 R87.1 R88.1 R89.1 R96.1 R97.1 R135.1 R136.1 R137.1 R138.1 R139.1 R140.1 R143.1 R146.1 R184.1 R185.1 R186.1 R187.1 R188.1 R189.1 R193.1 R196.1
RFGND: C1.2 C2.2 C3.2 C4.2 C5.2 C6.2 C7.2 C22.2 C23.2 C24.2 C25.2 C26.2 C27.2 C28.2 C43.2 C44.2 C45.2 C46.2 C47.2 C48.2 C49.2 C64.2 C65.2 C66.2 C67.2 C68.2 C69.2 C70.2 Ic1.1(GND) Ic1.2(GND) Ic1.4(GND) Ic1.5(GND) Ic1.6(GND) Ic1.7(GND) Ic1.9(GND) Ic1.10(GND) Ic1.11(GND) Ic1.12(GND) Ic1.14(GND) Ic1.15(GND) Ic1.21(GND) Ic3.1(GND) Ic3.2(GND) Ic4.1(GND) Ic4.2(GND) Ic4.4(GND) Ic4.5(GND) Ic4.6(GND) Ic4.7(GND) Ic4.9(GND) Ic4.10(GND) Ic4.11(GND) Ic4.12(GND) Ic4.14(GND) Ic4.15(GND) Ic4.21(GND) Ic5.1(GND) Ic5.2(GND) Ic5.3(GND) Ic5.4(GND) Ic5.6(GND) Ic5.8(GND) Ic5.9(GND) Ic5.11(GND) Ic5.12(GND) Ic6.10(GND) Ic6.11(GND) Ic6.12(GND) Ic6.18(GND) Ic6.21(gndPdle) Ic7.1(GND) Ic7.2(GND) Ic7.3(GND) Ic7.4(GND) Ic7.6(GND) Ic7.8(GND) Ic7.9(GND) Ic7.11(GND) Ic7.12(GND) Ic8.1(GND) Ic8.2(GND) Ic8.3(GND) Ic8.4(GND) Ic8.6(GND) Ic8.8(GND) Ic8.9(GND) Ic8.11(GND) Ic8.12(GND) Ic9.1(GND) Ic9.3(GND) Ic9.4(GND) Ic9.5(GND) Ic9.7(GND) Ic9.8(GND) Ic10.1(GND) Ic10.3(GND) Ic10.4(GND) Ic10.5(GND) Ic10.7(GND) Ic10.8(GND) Ic11.10(GND) Ic11.11(GND) Ic11.12(GND) Ic11.18(GND) Ic11.21(gndPdle) Ic12.2(GND) Ic12.4(GND) Ic13.1(GND) Ic13.3(GND) Ic13.4(GND) Ic13.5(GND) Ic13.7(GND) Ic13.8(GND) Ic13.10(GND) Ic13.11(GND) Ic13.12(GND) Ic13.14(GND) Ic17.1(GND) Ic17.2(GND) Ic17.4(GND) Ic17.5(GND) Ic17.6(GND) Ic17.7(GND) Ic17.9(GND) Ic17.10(GND) Ic17.11(GND) Ic17.12(GND) Ic17.14(GND) Ic17.15(GND) Ic17.21(GND) Ic18.1(GND) Ic18.2(GND) Ic19.1(GND) Ic19.2(GND) Ic19.4(GND) Ic19.5(GND) Ic19.6(GND) Ic19.7(GND) Ic19.9(GND) Ic19.10(GND) Ic19.11(GND) Ic19.12(GND) Ic19.14(GND) Ic19.15(GND) Ic19.21(GND) Ic20.1(GND) Ic20.2(GND) Ic20.3(GND) Ic20.4(GND) Ic20.6(GND) Ic20.8(GND) Ic20.9(GND) Ic20.11(GND) Ic20.12(GND) Ic21.10(GND) Ic21.11(GND) Ic21.12(GND) Ic21.18(GND) Ic21.21(gndPdle) Ic22.1(GND) Ic22.2(GND) Ic22.3(GND) Ic22.4(GND) Ic22.6(GND) Ic22.8(GND) Ic22.9(GND) Ic22.11(GND) Ic22.12(GND) Ic23.1(GND) Ic23.2(GND) Ic23.3(GND) Ic23.4(GND) Ic23.6(GND) Ic23.8(GND) Ic23.9(GND) Ic23.11(GND) Ic23.12(GND) Ic24.1(GND) Ic24.3(GND) Ic24.4(GND) Ic24.5(GND) Ic24.7(GND) Ic24.8(GND) Ic25.1(GND) Ic25.3(GND) Ic25.4(GND) Ic25.5(GND) Ic25.7(GND) Ic25.8(GND) Ic26.10(GND) Ic26.11(GND) Ic26.12(GND) Ic26.18(GND) Ic26.21(gndPdle) Ic27.2(GND) Ic27.4(GND) Ic28.1(GND) Ic28.3(GND) Ic28.4(GND) Ic28.5(GND) Ic28.7(GND) Ic28.8(GND) Ic28.10(GND) Ic28.11(GND) Ic28.12(GND) Ic28.14(GND) Ic32.1(GND) Ic32.2(GND) Ic32.4(GND) Ic32.5(GND) Ic32.6(GND) Ic32.7(GND) Ic32.9(GND) Ic32.10(GND) Ic32.11(GND) Ic32.12(GND) Ic32.14(GND) Ic32.15(GND) Ic32.21(GND) Ic34.1(GND) Ic34.2(GND) Ic35.1(GND) Ic35.2(GND) Ic35.4(GND) Ic35.5(GND) Ic35.6(GND) Ic35.7(GND) Ic35.9(GND) Ic35.10(GND) Ic35.11(GND) Ic35.12(GND) Ic35.14(GND) Ic35.15(GND) Ic35.21(GND) Ic36.1(GND) Ic36.2(GND) Ic36.3(GND) Ic36.4(GND) Ic36.6(GND) Ic36.8(GND) Ic36.9(GND) Ic36.11(GND) Ic36.12(GND) Ic37.10(GND) Ic37.11(GND) Ic37.12(GND) Ic37.18(GND) Ic37.21(gndPdle) Ic38.1(GND) Ic38.2(GND) Ic38.3(GND) Ic38.4(GND) Ic38.6(GND) Ic38.8(GND) Ic38.9(GND) Ic38.11(GND) Ic38.12(GND) Ic39.1(GND) Ic39.2(GND) Ic39.3(GND) Ic39.4(GND) Ic39.6(GND) Ic39.8(GND) Ic39.9(GND) Ic39.11(GND) Ic39.12(GND) Ic40.1(GND) Ic40.3(GND) Ic40.4(GND) Ic40.5(GND) Ic40.7(GND) Ic40.8(GND) Ic41.1(GND) Ic41.3(GND) Ic41.4(GND) Ic41.5(GND) Ic41.7(GND) Ic41.8(GND) Ic42.10(GND) Ic42.11(GND) Ic42.12(GND) Ic42.18(GND) Ic42.21(gndPdle) Ic43.2(GND) Ic43.4(GND) Ic44.1(GND) Ic44.3(GND) Ic44.4(GND) Ic44.5(GND) Ic44.7(GND) Ic44.8(GND) Ic44.10(GND) Ic44.11(GND) Ic44.12(GND) Ic44.14(GND) Ic47.1(GND) Ic47.2(GND) Ic47.4(GND) Ic47.5(GND) Ic47.6(GND) Ic47.7(GND) Ic47.9(GND) Ic47.10(GND) Ic47.11(GND) Ic47.12(GND) Ic47.14(GND) Ic47.15(GND) Ic47.21(GND) Ic49.1(GND) Ic49.2(GND) Ic50.1(GND) Ic50.2(GND) Ic50.4(GND) Ic50.5(GND) Ic50.6(GND) Ic50.7(GND) Ic50.9(GND) Ic50.10(GND) Ic50.11(GND) Ic50.12(GND) Ic50.14(GND) Ic50.15(GND) Ic50.21(GND) Ic51.1(GND) Ic51.2(GND) Ic51.3(GND) Ic51.4(GND) Ic51.6(GND) Ic51.8(GND) Ic51.9(GND) Ic51.11(GND) Ic51.12(GND) Ic52.10(GND) Ic52.11(GND) Ic52.12(GND) Ic52.18(GND) Ic52.21(gndPdle) Ic53.1(GND) Ic53.2(GND) Ic53.3(GND) Ic53.4(GND) Ic53.6(GND) Ic53.8(GND) Ic53.9(GND) Ic53.11(GND) Ic53.12(GND) Ic54.1(GND) Ic54.2(GND) Ic54.3(GND) Ic54.4(GND) Ic54.6(GND) Ic54.8(GND) Ic54.9(GND) Ic54.11(GND) Ic54.12(GND) Ic55.1(GND) Ic55.3(GND) Ic55.4(GND) Ic55.5(GND) Ic55.7(GND) Ic55.8(GND) Ic56.1(GND) Ic56.3(GND) Ic56.4(GND) Ic56.5(GND) Ic56.7(GND) Ic56.8(GND) Ic57.10(GND) Ic57.11(GND) Ic57.12(GND) Ic57.18(GND) Ic57.21(gndPdle) Ic58.2(GND) Ic58.4(GND) Ic59.1(GND) Ic59.3(GND) Ic59.4(GND) Ic59.5(GND) Ic59.7(GND) Ic59.8(GND) Ic59.10(GND) Ic59.11(GND) Ic59.12(GND) Ic59.14(GND) J1.1(GND) J1.2(GND) J1.3(GND) J1.4(GND) J2.1(GND) J2.2(GND) J2.3(GND) J2.4(GND) J3.1(GND) J3.2(GND) J3.3(GND) J3.4(GND) J4.1(GND) J4.2(GND) J4.3(GND) J4.4(GND) J5.1(GND) J5.2(GND) J5.3(GND) J5.4(GND) J6.1(GND) J6.2(GND) J6.3(GND) J6.4(GND) J7.1(GND) J7.2(GND) J7.3(GND) J7.4(GND) J8.1(GND) J8.2(GND) J8.3(GND) J8.4(GND) R1.1 R2.1 R3.1 R4.1 R5.1 R7.1 R8.1 R9.1 R12.1 R51.1 R52.1 R53.1 R54.1 R55.1 R57.1 R58.1 R59.1 R62.1 R99.1 R100.1 R101.1 R102.1 R103.1 R105.1 R106.1 R107.1 R110.1 R149.1 R150.1 R151.1 R152.1 R153.1 R155.1 R156.1 R157.1 R160.1
TGND: R15.1 R16.1 R17.1 R25.1 R26.1 R34.1 R35.1 R36.1 R43.1 R44.1 R49.1 R50.1 R68.1 R69.1 R70.1 R72.1 R73.1 R90.1 R91.1 R92.1 R93.1 R94.1 R115.1 R116.1 R117.1 R120.1 R121.1 R132.1 R133.1 R134.1 R141.1 R142.1 R147.1 R148.1 R167.1 R168.1 R169.1 R170.1 R171.1 R172.1 R173.1 R190.1 R191.1 R192.1
NetC8_1: C8.1 R22.1
NetC9_1: C9.1 R23.1
NetC10_1: C10.1 R24.1
NetC11_1: C11.1 R27.1
NetC12_1: C12.1 R28.1
NetC13_1: C13.1 R29.1
NetC14_2: C14.2 R30.1
NetC15_2: C15.2 R31.1
NetC16_2: C16.2 R32.1
NetC17_2: C17.2 R33.1
NetC29_1: C29.1 R74.1
NetC30_1: C30.1 R75.1
NetC31_1: C31.1 R76.1
NetC32_1: C32.1 R77.1
NetC33_1: C33.1 R78.1
NetC34_1: C34.1 R79.1
NetC35_2: C35.2 R80.1
NetC36_2: C36.2 R81.1
NetC37_2: C37.2 R82.1
NetC38_2: C38.2 R83.1
NetC50_1: C50.1 R122.1
NetC51_1: C51.1 R123.1
NetC52_1: C52.1 R124.1
NetC53_1: C53.1 R125.1
NetC54_1: C54.1 R126.1
NetC55_1: C55.1 R127.1
NetC56_2: C56.2 R128.1
NetC57_2: C57.2 R129.1
NetC58_2: C58.2 R130.1
NetC59_2: C59.2 R131.1
NetC72_1: C72.1 R174.1
NetC73_1: C73.1 R175.1
NetC74_1: C74.1 R176.1
NetC75_2: C75.2 R180.1
NetC76_2: C76.2 R181.1
NetC77_1: C77.1 R177.1
NetC78_1: C78.1 R178.1
NetC79_1: C79.1 R179.1
NetC80_2: C80.2 R182.1
NetC81_2: C81.2 R183.1
NetIc1_3: Ic1.3(RF1) Ic19.13(RF2) ; port AC1RF
NetIc1_8: Ic1.8(RFcom) J1.5(RFin)
NetIc1_13: Ic1.13(RF2) Ic4.13(RF2) ; port RFa
NetIc1_16: Ic1.16(Ctr2) R18.1 R30.2 R45.2
NetIc1_17: Ic1.17(Ctr1) R20.1 R31.2 R46.2
NetIc2_1: Ic2.1 ; port RTD-22A
NetIc2_2: Ic2.2 ; port RTD-21A
NetIc2_3: Ic2.3 ; port RTD-23A
NetIc3_3: Ic3.3(InA) Ic4.8(RFcom)
NetIc3_4: Ic3.4(InB) ; port A1call
NetIc3_6: Ic3.6(Out) Ic12.1(RF1)
NetIc4_3: Ic4.3(RF1) Ic17.13(RF2) ; port AC2RF
NetIc4_16: Ic4.16(Ctr2) R21.2 R32.2 R47.2
NetIc4_17: Ic4.17(Ctr1) R19.2 R33.2 R48.2
NetIc5_5: Ic5.5(RFout) Ic6.2(RFin)
NetIc5_10: Ic5.10(RFin) Ic9.6(Out)
NetIc6_1: Ic6.1(C16) R11.2
NetIc6_3: Ic6.3(Data) R13.2
NetIc6_4: Ic6.4(Clk) Ic11.4(Clk) R23.2 R28.2 R38.2 R41.2 ; port A-Clk
NetIc6_5: Ic6.5(LE) Ic11.5(LE) R24.2 R29.2 R39.2 R42.2 ; port A-LE
NetIc6_14: Ic6.14(RFout) Ic10.2(In)
NetIc6_15: Ic6.15(C8) R9.2
NetIc6_16: Ic6.16(C4) R7.2
NetIc6_17: Ic6.17(C2) R5.2
NetIc6_19: Ic6.19(C1) R3.2
NetIc6_20: Ic6.20(C0.5) R1.2
NetIc7_5: Ic7.5(RFout) Ic11.2(RFin)
NetIc7_10: Ic7.10(RFin) Ic10.6(Out)
NetIc8_5: Ic8.5(RFout) Ic13.2(In)
NetIc8_10: Ic8.10(RFin) Ic11.14(RFout)
NetIc9_2: Ic9.2(In) Ic12.3(RF2)
NetIc11_1: Ic11.1(C16) R12.2
NetIc11_3: Ic11.3(Data) R14.2
NetIc11_15: Ic11.15(C8) R10.2
NetIc11_16: Ic11.16(C4) R8.2
NetIc11_17: Ic11.17(C2) R6.2
NetIc11_19: Ic11.19(C1) R4.2
NetIc11_20: Ic11.20(C0.5) R2.2
NetIc13_9: Ic13.9(Out) J2.5(RFin)
NetIc14_1: Ic14.1 ; port RTD-12A
NetIc14_2: Ic14.2 ; port RTD-11A
NetIc14_3: Ic14.3 ; port RTD-13A
NetIc15_1: Ic15.1 ; port RTD-32A
NetIc15_2: Ic15.2 ; port RTD-31A
NetIc15_3: Ic15.3 ; port RTD-33A
NetIc16_1: Ic16.1 ; port RTD-12AC
NetIc16_2: Ic16.2 ; port RTD-11AC
NetIc16_3: Ic16.3 ; port RTD-13AC
NetIc17_3: Ic17.3(RF1) Ic19.3(RF1) ; port RFc
NetIc17_8: Ic17.8(RFcom) J3.5(RFin)
NetIc17_16: Ic17.16(Ctr2) R66.1 R80.2 R95.2
NetIc17_17: Ic17.17(Ctr1) R67.1 R81.2 R96.2
NetIc18_3: Ic18.3(InA) Ic19.8(RFcom)
NetIc18_4: Ic18.4(InB) ; port C1call
NetIc18_6: Ic18.6(Out) Ic27.1(RF1)
NetIc19_16: Ic19.16(Ctr2) R71.2 R82.2 R97.2
NetIc19_17: Ic19.17(Ctr1) R65.2 R83.2 R98.2
NetIc20_5: Ic20.5(RFout) Ic21.2(RFin)
NetIc20_10: Ic20.10(RFin) Ic24.6(Out)
NetIc21_1: Ic21.1(C16) R61.2
NetIc21_3: Ic21.3(Data) R63.2
NetIc21_4: Ic21.4(Clk) Ic26.4(Clk) R75.2 R78.2 R85.2 R88.2 ; port C-Clk
NetIc21_5: Ic21.5(LE) Ic26.5(LE) R76.2 R79.2 R86.2 R89.2 ; port C-LE
NetIc21_14: Ic21.14(RFout) Ic25.2(In)
NetIc21_15: Ic21.15(C8) R59.2
NetIc21_16: Ic21.16(C4) R57.2
NetIc21_17: Ic21.17(C2) R55.2
NetIc21_19: Ic21.19(C1) R53.2
NetIc21_20: Ic21.20(C0.5) R51.2
NetIc22_5: Ic22.5(RFout) Ic26.2(RFin)
NetIc22_10: Ic22.10(RFin) Ic25.6(Out)
NetIc23_5: Ic23.5(RFout) Ic28.2(In)
NetIc23_10: Ic23.10(RFin) Ic26.14(RFout)
NetIc24_2: Ic24.2(In) Ic27.3(RF2)
NetIc26_1: Ic26.1(C16) R62.2
NetIc26_3: Ic26.3(Data) R64.2
NetIc26_15: Ic26.15(C8) R60.2
NetIc26_16: Ic26.16(C4) R58.2
NetIc26_17: Ic26.17(C2) R56.2
NetIc26_19: Ic26.19(C1) R54.2
NetIc26_20: Ic26.20(C0.5) R52.2
NetIc28_9: Ic28.9(Out) J4.5(RFin)
NetIc29_1: Ic29.1 ; port RTD-12C
NetIc29_2: Ic29.2 ; port RTD-11C
NetIc29_3: Ic29.3 ; port RTD-13C
NetIc30_1: Ic30.1 ; port RTD-32C
NetIc30_2: Ic30.2 ; port RTD-31C
NetIc30_3: Ic30.3 ; port RTD-33C
NetIc31_1: Ic31.1 ; port RTD-22C
NetIc31_2: Ic31.2 ; port RTD-21C
NetIc31_3: Ic31.3 ; port RTD-23C
NetIc32_3: Ic32.3(RF1) Ic50.13(RF2) ; port BD1RF
NetIc32_8: Ic32.8(RFcom) J5.5(RFin)
NetIc32_13: Ic32.13(RF2) Ic35.13(RF2) ; port RFb
NetIc32_16: Ic32.16(Ctr2) R114.1 R128.2 R143.2
NetIc32_17: Ic32.17(Ctr1) R118.1 R129.2 R144.2
NetIc33_1: Ic33.1 ; port RTD-22B
NetIc33_2: Ic33.2 ; port RTD-21B
NetIc33_3: Ic33.3 ; port RTD-23B
NetIc34_3: Ic34.3(InA) Ic35.8(RFcom)
NetIc34_4: Ic34.4(InB) ; port B1call
NetIc34_6: Ic34.6(Out) Ic43.1(RF1)
NetIc35_3: Ic35.3(RF1) Ic47.13(RF2) ; port BD2RF
NetIc35_16: Ic35.16(Ctr2) R119.2 R130.2 R145.2
NetIc35_17: Ic35.17(Ctr1) R113.2 R131.2 R146.2
NetIc36_5: Ic36.5(RFout) Ic37.2(RFin)
NetIc36_10: Ic36.10(RFin) Ic40.6(Out)
NetIc37_1: Ic37.1(C16) R109.2
NetIc37_3: Ic37.3(Data) R111.2
NetIc37_4: Ic37.4(Clk) Ic42.4(Clk) R123.2 R126.2 R136.2 R139.2 ; port B-Clk
NetIc37_5: Ic37.5(LE) Ic42.5(LE) R124.2 R127.2 R137.2 R140.2 ; port B-LE
NetIc37_14: Ic37.14(RFout) Ic41.2(In)
NetIc37_15: Ic37.15(C8) R107.2
NetIc37_16: Ic37.16(C4) R105.2
NetIc37_17: Ic37.17(C2) R103.2
NetIc37_19: Ic37.19(C1) R101.2
NetIc37_20: Ic37.20(C0.5) R99.2
NetIc38_5: Ic38.5(RFout) Ic42.2(RFin)
NetIc38_10: Ic38.10(RFin) Ic41.6(Out)
NetIc39_5: Ic39.5(RFout) Ic44.2(In)
NetIc39_10: Ic39.10(RFin) Ic42.14(RFout)
NetIc40_2: Ic40.2(In) Ic43.3(RF2)
NetIc42_1: Ic42.1(C16) R110.2
NetIc42_3: Ic42.3(Data) R112.2
NetIc42_15: Ic42.15(C8) R108.2
NetIc42_16: Ic42.16(C4) R106.2
NetIc42_17: Ic42.17(C2) R104.2
NetIc42_19: Ic42.19(C1) R102.2
NetIc42_20: Ic42.20(C0.5) R100.2
NetIc44_9: Ic44.9(Out) J6.5(RFin)
NetIc45_1: Ic45.1 ; port RTD-12B
NetIc45_2: Ic45.2 ; port RTD-11B
NetIc45_3: Ic45.3 ; port RTD-13B
NetIc46_1: Ic46.1 ; port RTD-32B
NetIc46_2: Ic46.2 ; port RTD-31B
NetIc46_3: Ic46.3 ; port RTD-33B
NetIc47_3: Ic47.3(RF1) Ic50.3(RF1) ; port RFd
NetIc47_8: Ic47.8(RFcom) J7.5(RFin)
NetIc47_16: Ic47.16(Ctr2) R164.1 R182.2 R195.2
NetIc47_17: Ic47.17(Ctr1) R165.1 R183.2 R196.2
NetIc48_1: Ic48.1 ; port RTD-12BD
NetIc48_2: Ic48.2 ; port RTD-11BD
NetIc48_3: Ic48.3 ; port RTD-13BD
NetIc49_3: Ic49.3(InA) Ic50.8(RFcom)
NetIc49_4: Ic49.4(InB) ; port D1call
NetIc49_6: Ic49.6(Out) Ic58.1(RF1)
NetIc50_16: Ic50.16(Ctr2) R166.2 R180.2 R193.2
NetIc50_17: Ic50.17(Ctr1) R163.2 R181.2 R194.2
NetIc51_5: Ic51.5(RFout) Ic52.2(RFin)
NetIc51_10: Ic51.10(RFin) Ic55.6(Out)
NetIc52_1: Ic52.1(C16) R159.2
NetIc52_3: Ic52.3(Data) R161.2
NetIc52_4: Ic52.4(Clk) Ic57.4(Clk) R175.2 R178.2 R185.2 R188.2 ; port D-Clk
NetIc52_5: Ic52.5(LE) Ic57.5(LE) R176.2 R179.2 R186.2 R189.2 ; port D-LE
NetIc52_14: Ic52.14(RFout) Ic56.2(In)
NetIc52_15: Ic52.15(C8) R157.2
NetIc52_16: Ic52.16(C4) R155.2
NetIc52_17: Ic52.17(C2) R153.2
NetIc52_19: Ic52.19(C1) R151.2
NetIc52_20: Ic52.20(C0.5) R149.2
NetIc53_5: Ic53.5(RFout) Ic57.2(RFin)
NetIc53_10: Ic53.10(RFin) Ic56.6(Out)
NetIc54_5: Ic54.5(RFout) Ic59.2(In)
NetIc54_10: Ic54.10(RFin) Ic57.14(RFout)
NetIc55_2: Ic55.2(In) Ic58.3(RF2)
NetIc57_1: Ic57.1(C16) R160.2
NetIc57_3: Ic57.3(Data) R162.2
NetIc57_15: Ic57.15(C8) R158.2
NetIc57_16: Ic57.16(C4) R156.2
NetIc57_17: Ic57.17(C2) R154.2
NetIc57_19: Ic57.19(C1) R152.2
NetIc57_20: Ic57.20(C0.5) R150.2
NetIc59_9: Ic59.9(Out) J8.5(RFin)
NetIc60_1: Ic60.1 ; port RTD-12D
NetIc60_2: Ic60.2 ; port RTD-11D
NetIc60_3: Ic60.3 ; port RTD-13D
NetIc61_1: Ic61.1 ; port RTD-32D
NetIc61_2: Ic61.2 ; port RTD-31D
NetIc61_3: Ic61.3 ; port RTD-33D
NetIc62_1: Ic62.1 ; port RTD-22D
NetIc62_2: Ic62.2 ; port RTD-21D
NetIc62_3: Ic62.3 ; port RTD-23D
NetJ10_13: R49.2 R50.2 ; port Heat-1AC
NetJ10_14: R147.2 R148.2 ; port Heat-1BD
NetJ10_21: R170.2 R171.2 R172.2 R173.2 ; port Heat-2D
NetJ10_42: R120.2 R121.2 R141.2 R142.2 ; port Heat-2B
NetJ10_56: R15.2 R16.2 R17.2 R34.2 R35.2 R36.2 ; port Heat-1A
NetJ10_57: R68.2 R69.2 R70.2 R90.2 R91.2 R92.2 ; port Heat-1C
NetJ10_58: R115.2 R116.2 R117.2 R132.2 R133.2 R134.2 ; port Heat-1B
NetJ10_59: R167.2 R168.2 R169.2 R190.2 R191.2 R192.2 ; port Heat-1D
NetJ10_61: R25.2 R26.2 R43.2 R44.2 ; port Heat-2A
NetJ10_62: R72.2 R73.2 R93.2 R94.2 ; port Heat-2C
NetJ11_1: R163.1 ; port D2Ctr1
NetJ11_2: R166.1 ; port D2Ctr2
NetJ11_3: R165.2 ; port D1Ctr1
NetJ11_4: R119.1 ; port B2Ctr2
NetJ11_6: R118.2 ; port B1Ctr1
NetJ11_7: R67.2 ; port C1Ctr1
NetJ11_8: R65.1 ; port C2Ctr1
NetJ11_22: R111.1 R122.2 R135.2 ; port B1-Data
NetJ11_23: R161.1 R174.2 R184.2 ; port D1-Data
NetJ11_24: R164.2 ; port D1Ctr2
NetJ11_25: R113.1 ; port B2Ctr1
NetJ11_27: R114.2 ; port B1Ctr2
NetJ11_28: R66.2 ; port C1Ctr2
NetJ11_29: R71.1 ; port C2Ctr2
NetJ11_43: R13.1 R22.2 R37.2 ; port A1-Data
NetJ11_44: R63.1 R74.2 R84.2 ; port C1-Data
NetJ11_47: R162.1 R177.2 R187.2 ; port D2-Data
NetJ11_50: R112.1 R125.2 R138.2 ; port B2-Data
NetJ11_53: R64.1 R77.2 R87.2 ; port C2-Data
NetJ11_56: R14.1 R27.2 R40.2 ; port A2-Data
NetJ11_57: R18.2 ; port A1Ctr2
NetJ11_58: R20.2 ; port A1Ctr1
NetJ11_59: R21.1 ; port A2Ctr2
NetJ11_60: R19.1 ; port A2Ctr1

Not connected (* = marked no-connect by the designer): Ic3 5(GND); Ic5 0(GND); Ic6 7(N/C) 8(N/C); Ic7 0(GND); Ic8 0(GND); Ic11 7(N/C) 8(N/C); Ic13 6(NC) 13(NC); Ic18 5(GND); Ic20 0(GND); Ic21 7(N/C) 8(N/C); Ic22 0(GND); Ic23 0(GND); Ic26 7(N/C) 8(N/C); Ic28 6(NC) 13(NC); Ic34 5(GND); Ic36 0(GND); Ic37 7(N/C) 8(N/C); Ic38 0(GND); Ic39 0(GND); Ic42 7(N/C) 8(N/C); Ic44 6(NC) 13(NC); Ic49 5(GND); Ic51 0(GND); Ic52 7(N/C) 8(N/C); Ic53 0(GND); Ic54 0(GND); Ic57 7(N/C) 8(N/C); Ic59 6(NC) 13(NC)

### Notes on the sheet
- Sheet 1: RF Signal Path
- (near J1) Antenna A
- (near R11) 6x
- (near R12) 6x
- Std -20 dBm @ 476 MHz
- *Ground must be less than 2 mm from pin 12 for proper device operation (for all DAT-31R5-SP+)
- Supply Filters
- (near J3) Antenna C
- (near R61) 6x
- (near R62) 6x
- (near J5) Antenna B
- (near R109) 6x
- (near R110) 6x
- (near J7) Antenna D
- (near R159) 6x
- (near R160) 6x
- (in symbol 132289RP) RF
- (in symbol Minicircuits-HSWA2-30DR+) 50
- (in symbol Minicircuits-SBTC-2-10L) NC